# EAGLE design Precision LPC no USB (EAGLE 6.2)
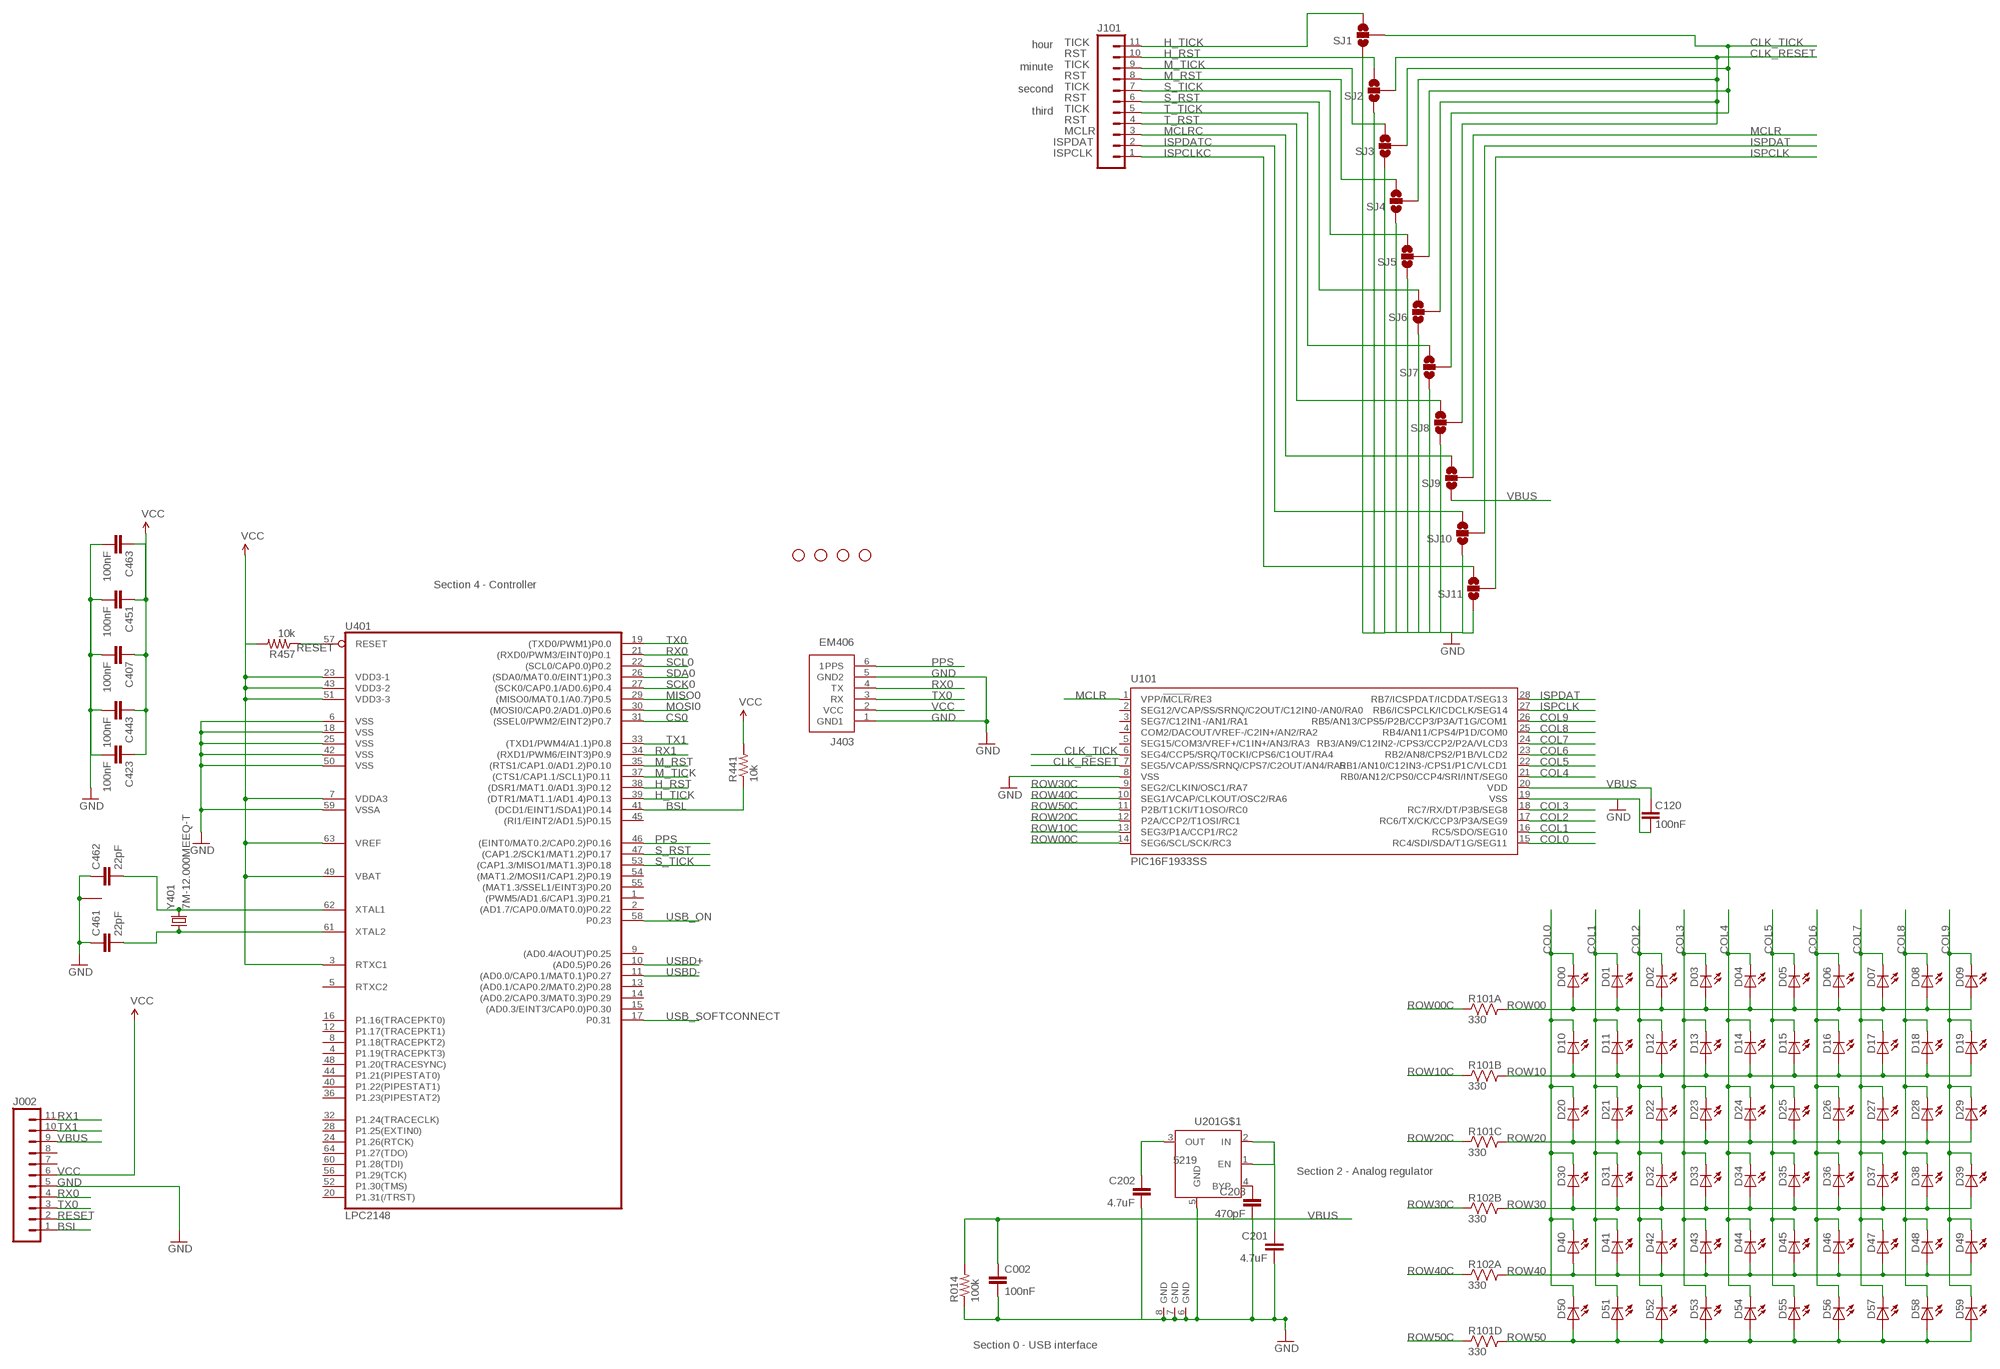
[diagram p0: schematic, sheet 1]

## Parts
C002  100nF  CAP0402-CAP  [0402-CAP]
C120  100nF  CAP0402-CAP  [0402-CAP]
C201  4.7uF  CAP0402-CAP  [0402-CAP]
C202  4.7uF  CAP0402-CAP  [0402-CAP]
C203  470pF  CAP0402-CAP  [0402-CAP]
C407  100nF  CAP0402-CAP  [0402-CAP]
C423  100nF  CAP0402-CAP  [0402-CAP]
C443  100nF  CAP0402-CAP  [0402-CAP]
C451  100nF  CAP0402-CAP  [0402-CAP]
C461  22pF  CAP0402-CAP  [0402-CAP]
C462  22pF  CAP0402-CAP  [0402-CAP]
C463  100nF  CAP0402-CAP  [0402-CAP]
D00  LED3MM  [LED3MM]
D01  LED3MM  [LED3MM]
D02  LED3MM  [LED3MM]
D03  LED3MM  [LED3MM]
D04  LED3MM  [LED3MM]
D05  LED3MM  [LED3MM]
D06  LED3MM  [LED3MM]
D07  LED3MM  [LED3MM]
D08  LED3MM  [LED3MM]
D09  LED3MM  [LED3MM]
D10  LED3MM  [LED3MM]
D11  LED3MM  [LED3MM]
D12  LED3MM  [LED3MM]
D13  LED3MM  [LED3MM]
D14  LED3MM  [LED3MM]
D15  LED3MM  [LED3MM]
D16  LED3MM  [LED3MM]
D17  LED3MM  [LED3MM]
D18  LED3MM  [LED3MM]
D19  LED3MM  [LED3MM]
D20  LED3MM  [LED3MM]
D21  LED3MM  [LED3MM]
D22  LED3MM  [LED3MM]
D23  LED3MM  [LED3MM]
D24  LED3MM  [LED3MM]
D25  LED3MM  [LED3MM]
D26  LED3MM  [LED3MM]
D27  LED3MM  [LED3MM]
D28  LED3MM  [LED3MM]
D29  LED3MM  [LED3MM]
D30  LED3MM  [LED3MM]
D31  LED3MM  [LED3MM]
D32  LED3MM  [LED3MM]
D33  LED3MM  [LED3MM]
D34  LED3MM  [LED3MM]
D35  LED3MM  [LED3MM]
D36  LED3MM  [LED3MM]
D37  LED3MM  [LED3MM]
D38  LED3MM  [LED3MM]
D39  LED3MM  [LED3MM]
D40  LED3MM  [LED3MM]
D41  LED3MM  [LED3MM]
D42  LED3MM  [LED3MM]
D43  LED3MM  [LED3MM]
D44  LED3MM  [LED3MM]
D45  LED3MM  [LED3MM]
D46  LED3MM  [LED3MM]
D47  LED3MM  [LED3MM]
D48  LED3MM  [LED3MM]
D49  LED3MM  [LED3MM]
D50  LED3MM  [LED3MM]
D51  LED3MM  [LED3MM]
D52  LED3MM  [LED3MM]
D53  LED3MM  [LED3MM]
D54  LED3MM  [LED3MM]
D55  LED3MM  [LED3MM]
D56  LED3MM  [LED3MM]
D57  LED3MM  [LED3MM]
D58  LED3MM  [LED3MM]
D59  LED3MM  [LED3MM]
J002  M11PTH  [1X11]
J101  M11PTH  [1X11]
J403  EM406  [EM406@1]
JP3  STAND-OFF  [STAND-OFF]
JP4  STAND-OFF  [STAND-OFF]
JP5  STAND-OFF  [STAND-OFF]
JP6  STAND-OFF  [STAND-OFF]
R014  100k  RESISTOR0402-RES  [0402-RES]
R101  330  CRA06S-8  [CRA06]
R102  330  CRA06S-8  [CRA06]
R441  10k  RESISTOR0402-RES  [0402-RES]
R457  10k  RESISTOR0402-RES  [0402-RES]
SJ1  SOLDERJUMPER_2WAYS  [SJ_3]
SJ2  SOLDERJUMPER_2WAYS  [SJ_3]
SJ3  SOLDERJUMPER_2WAYS  [SJ_3]
SJ4  SOLDERJUMPER_2WAYS  [SJ_3]
SJ5  SOLDERJUMPER_2WAYS  [SJ_3]
SJ6  SOLDERJUMPER_2WAYS  [SJ_3]
SJ7  SOLDERJUMPER_2WAYS  [SJ_3]
SJ8  SOLDERJUMPER_2WAYS  [SJ_3]
SJ9  SOLDERJUMPER_2WAYS  [SJ_3]
SJ10  SOLDERJUMPER_2WAYS  [SJ_3]
SJ11  SOLDERJUMPER_2WAYS  [SJ_3]
U101  PIC16F1933SS  [SSOP28]
U201  5219  MIC5219FMM  [MSOP08]
U401  LPC2148  LPC213X  [SQFP-S-10X10-64]
Y401  7M-12.000MEEQ-T  TSX-3225  [CRYSTAL_SMD]

## Nets
BSL: J002.1 R441.1 U401.41((DCD1/EINT1/SDA1)P0.14)
CLK_RESET: SJ2.2 SJ4.2 SJ6.2 SJ8.2 U101.7(SEG5/VCAP/SS/SRNQ/CPS7/C2OUT/AN4/RA5)
CLK_TICK: SJ1.2 SJ3.2 SJ5.2 SJ7.2 U101.6(SEG4/CCP5/SRQ/T0CKI/CPS6/C1OUT/RA4)
COL0: D00.K(C) D10.K(C) D20.K(C) D30.K(C) D40.K(C) D50.K(C) U101.15(RC4/SDI/SDA/T1G/SEG11)
COL1: D01.K(C) D11.K(C) D21.K(C) D31.K(C) D41.K(C) D51.K(C) U101.16(RC5/SDO/SEG10)
COL2: D02.K(C) D12.K(C) D22.K(C) D32.K(C) D42.K(C) D52.K(C) U101.17(RC6/TX/CK/CCP3/P3A/SEG9)
COL3: D03.K(C) D13.K(C) D23.K(C) D33.K(C) D43.K(C) D53.K(C) U101.18(RC7/RX/DT/P3B/SEG8)
COL4: D04.K(C) D14.K(C) D24.K(C) D34.K(C) D44.K(C) D54.K(C) U101.21(RB0/AN12/CPS0/CCP4/SRI/INT/SEG0)
COL5: D05.K(C) D15.K(C) D25.K(C) D35.K(C) D45.K(C) D55.K(C) U101.22(RB1/AN10/C12IN3-/CPS1/P1C/VLCD1)
COL6: D06.K(C) D16.K(C) D26.K(C) D36.K(C) D46.K(C) D56.K(C) U101.23(RB2/AN8/CPS2/P1B/VLCD2)
COL7: D07.K(C) D17.K(C) D27.K(C) D37.K(C) D47.K(C) D57.K(C) U101.24(RB3/AN9/C12IN2-/CPS3/CCP2/P2A/VLCD3)
COL8: D08.K(C) D18.K(C) D28.K(C) D38.K(C) D48.K(C) D58.K(C) U101.25(RB4/AN11/CPS4/P1D/COM0)
COL9: D09.K(C) D19.K(C) D29.K(C) D39.K(C) D49.K(C) D59.K(C) U101.26(RB5/AN13/CPS5/P2B/CCP3/P3A/T1G/COM1)
CS0: U401.31((SSEL0/PWM2/EINT2)P0.7)
GND [power]: C002.2 C120.1 C201.2 C202.2 C203.2 C407.2 C423.2 C443.2 C451.2 C461.1 C462.1 C463.2 J002.5 J403.1(GND1) J403.5(GND2) R014.1 SJ1.1 SJ2.1 SJ3.1 SJ4.1 SJ5.1 SJ6.1 SJ7.1 SJ8.1 SJ10.1 SJ11.1 U101.8(VSS) U101.19(VSS) U201.5(GND) U201.6(GND) U201.7(GND) U201.8(GND) U401.6(VSS) U401.18(VSS) U401.25(VSS) U401.42(VSS) U401.50(VSS) U401.59(VSSA) Y401.2 Y401.4
H_RST: J101.10 SJ2.3 U401.38((DSR1/MAT1.0/AD1.3)P0.12)
H_TICK: J101.11 SJ1.3 U401.39((DTR1/MAT1.1/AD1.4)P0.13)
ISPCLK: SJ11.2 U101.27(RB6/ICSPCLK/ICDCLK/SEG14)
ISPCLKC: J101.1 SJ11.3
ISPDAT: SJ10.2 U101.28(RB7/ICSPDAT/ICDDAT/SEG13)
ISPDATC: J101.2 SJ10.3
M_RST: J101.8 SJ4.3 U401.35((RTS1/CAP1.0/AD1.2)P0.10)
M_TICK: J101.9 SJ3.3 U401.37((CTS1/CAP1.1/SCL1)P0.11)
MCLR: SJ9.2 U101.1(VPP/!MCLR!/RE3)
MCLRC: J101.3 SJ9.3
MISO0: U401.29((MISO0/MAT0.1/A0.7)P0.5)
MOSI0: U401.30((MOSI0/CAP0.2/AD1.0)P0.6)
N$1 [power]: C202.1 U201.3(OUT)
N$3: C203.1 U201.4(BYP)
PPS: J403.6(1PPS) U401.46((EINT0/MAT0.2/CAP0.2)P0.16)
RESET: J002.2 R457.1 U401.57(RESET)
ROW00: D00.A D01.A D02.A D03.A D04.A D05.A D06.A D07.A D08.A D09.A R101.8
ROW00C: R101.1 U101.14(SEG6/SCL/SCK/RC3)
ROW10: D10.A D11.A D12.A D13.A D14.A D15.A D16.A D17.A D18.A D19.A R101.7
ROW10C: R101.2 U101.13(SEG3/P1A/CCP1/RC2)
ROW20: D20.A D21.A D22.A D23.A D24.A D25.A D26.A D27.A D28.A D29.A R101.6
ROW20C: R101.3 U101.12(P2A/CCP2/T1OSI/RC1)
ROW30: D30.A D31.A D32.A D33.A D34.A D35.A D36.A D37.A D38.A D39.A R102.7
ROW30C: R102.2 U101.9(SEG2/CLKIN/OSC1/RA7)
ROW40: D40.A D41.A D42.A D43.A D44.A D45.A D46.A D47.A D48.A D49.A R102.8
ROW40C: R102.1 U101.10(SEG1/VCAP/CLKOUT/OSC2/RA6)
ROW50: D50.A D51.A D52.A D53.A D54.A D55.A D56.A D57.A D58.A D59.A R101.5
ROW50C: R101.4 U101.11(P2B/T1CKI/T1OSO/RC0)
RX0: J002.4 J403.4(TX) U401.21((RXD0/PWM3/EINT0)P0.1)
RX1: J002.11 U401.34((RXD1/PWM6/EINT3)P0.9)
S_RST: J101.6 SJ6.3 U401.47((CAP1.2/SCK1/MAT1.2)P0.17)
S_TICK: J101.7 SJ5.3 U401.53((CAP1.3/MISO1/MAT1.3)P0.18)
SCK0: U401.27((SCK0/CAP0.1/AD0.6)P0.4)
SCL0: U401.22((SCL0/CAP0.0)P0.2)
SDA0: U401.26((SDA0/MAT0.0/EINT1)P0.3)
T_RST: J101.4 SJ8.3
T_TICK: J101.5 SJ7.3
TX0: J002.3 J403.3(RX) U401.19((TXD0/PWM1)P0.0)
TX1: J002.10 U401.33((TXD1/PWM4/A1.1)P0.8)
USB_ON: U401.58(P0.23)
USB_SOFTCONNECT: U401.17(P0.31)
USBD+: U401.10((AD0.5)P0.26)
USBD-: U401.11((AD0.0/CAP0.1/MAT0.1)P0.27)
VBUS: C002.1 C120.2 C201.1 J002.9 R014.2 SJ9.1 U101.20(VDD) U201.1(EN) U201.2(IN)
VCC [power]: C407.1 C423.1 C443.1 C451.1 C463.1 J002.6 J403.2(VCC) R441.2 R457.2 U401.3(RTXC1) U401.7(VDDA3) U401.23(VDD3-1) U401.43(VDD3-2) U401.49(VBAT) U401.51(VDD3-3) U401.63(VREF)
XTAL3: C462.2 U401.62(XTAL1) Y401.3
XTAL4: C461.2 U401.61(XTAL2) Y401.1
Unconnected: J002.7 J002.8 R102.3 R102.4 R102.5 R102.6 U101.2(SEG12/VCAP/SS/SRNQ/C2OUT/C12IN0-/AN0/RA0) U101.3(SEG7/C12IN1-/AN1/RA1) U101.4(COM2/DACOUT/VREF-/C2IN+/AN2/RA2) U101.5(SEG15/COM3/VREF+/C1IN+/AN3/RA3) U401.1((PWM5/AD1.6/CAP1.3)P0.21) U401.2((AD1.7/CAP0.0/MAT0.0)P0.22) U401.4(P1.19(TRACEPKT3)) U401.5(RTXC2) U401.8(P1.18(TRACEPKT2)) U401.9((AD0.4/AOUT)P0.25) U401.12(P1.17(TRACEPKT1)) U401.13((AD0.1/CAP0.2/MAT0.2)P0.28) U401.14((AD0.2/CAP0.3/MAT0.3)P0.29) U401.15((AD0.3/EINT3/CAP0.0)P0.30) U401.16(P1.16(TRACEPKT0)) U401.20(P1.31(/TRST)) U401.24(P1.26(RTCK)) U401.28(P1.25(EXTIN0)) U401.32(P1.24(TRACECLK)) U401.36(P1.23(PIPESTAT2)) U401.40(P1.22(PIPESTAT1)) U401.44(P1.21(PIPESTAT0)) U401.45((RI1/EINT2/AD1.5)P0.15) U401.48(P1.20(TRACESYNC)) U401.52(P1.30(TMS)) U401.54((MAT1.2/MOSI1/CAP1.2)P0.19) U401.55((MAT1.3/SSEL1/EINT3)P0.20) U401.56(P1.29(TCK)) U401.60(P1.28(TDI)) U401.64(P1.27(TDO))

## Notes on the sheet
- hour
- TICK
- RST
- minute
- TICK
- RST
- second
- TICK
- RST
- third
- TICK
- RST
- MCLR
- ISPDAT
- ISPCLK
- Section 4 - Controller
- Section 2 - Analog regulator
- Section 0 - USB interface

## Library data of the parts
C002 C120 C201-C203 C407 C423 C443 C451 C461-C463 = SparkFun:CAP: Capacitor Standard 0603 ceramic capacitor, and 0.1" leaded capacitor.
D00 D01-D09 D10-D59 = SparkFun:LED: LEDs Standard schematic elements and footprints for 5mm, 3mm, 1206, and 0603 sized LEDs. 5mm - Spark Fun Electronics SKU : COM-00529 (and others)
J002 J101 = SparkFun:M11: Header 11 Standard 11-pin 0.1" header. Use with straight break away headers (SKU : PRT-00116), right angle break away headers (PRT-00553), swiss pins (PRT-00743), machine pins (PRT-00117), and female headers (PRT-00115).
J403 = SparkFun:EM406: EM406 Connector Proven layout and schematic for EM406 connector. Spark Fun Electronics SKU : GPS-00579
JP3-JP6 = SparkFun:STAND-OFF: Stand Off This is the mechanical footprint for a #4 phillips button head screw. Use the keepout ring to avoid running the screw head into surrounding components. SKU : PRT-00447
R014 R441 R457 = SparkFun:RESISTOR: Resistor Basic schematic elements and footprints for 0603, 1206, and PTH resistors.
R101 R102 = KwanSystems:CRA06S-8
SJ1-SJ11 = SparkFun:SOLDERJUMPER_2WAY: Solder Jumper 2 way solder jumper
U101 = microchip:PIC16F19*: Flash-Based, 8-Bit CMOS Microcontrollers wtih LCD Driver and nanoWatt XLP Technology Auto generated by make-symbol-device-package-bsdl.ulp Rev. 33 Source: http://ww1.microchip.com/downloads/en/DeviceDoc/41364D.pdf; MPN: PIC16F1933T-I/SS; OC_FARNELL: 1755815; OC_NEWARK: 08R1942
U201 = v-reg-micrel:MIC5219FMM: VOLTAGE REGULATOR; OC_FARNELL: unknown; OC_NEWARK: unknown
U401 = SparkFun:LPC213X: LPC213x Schematic element and footprint for NXP LPC213x. Spark Fun Electronics SKU : COM-00520
Y401 = KwanSystems:TSX-3225

## Net classes
0 default: width 0.203 mm, drill 0.508 mm, clearance 0.203 mm
1 power: width 0.203 mm, drill 0.508 mm, clearance 0.203 mm
2 hv: width 0.203 mm, drill 0.508 mm, clearance 0.203 mm

## Board
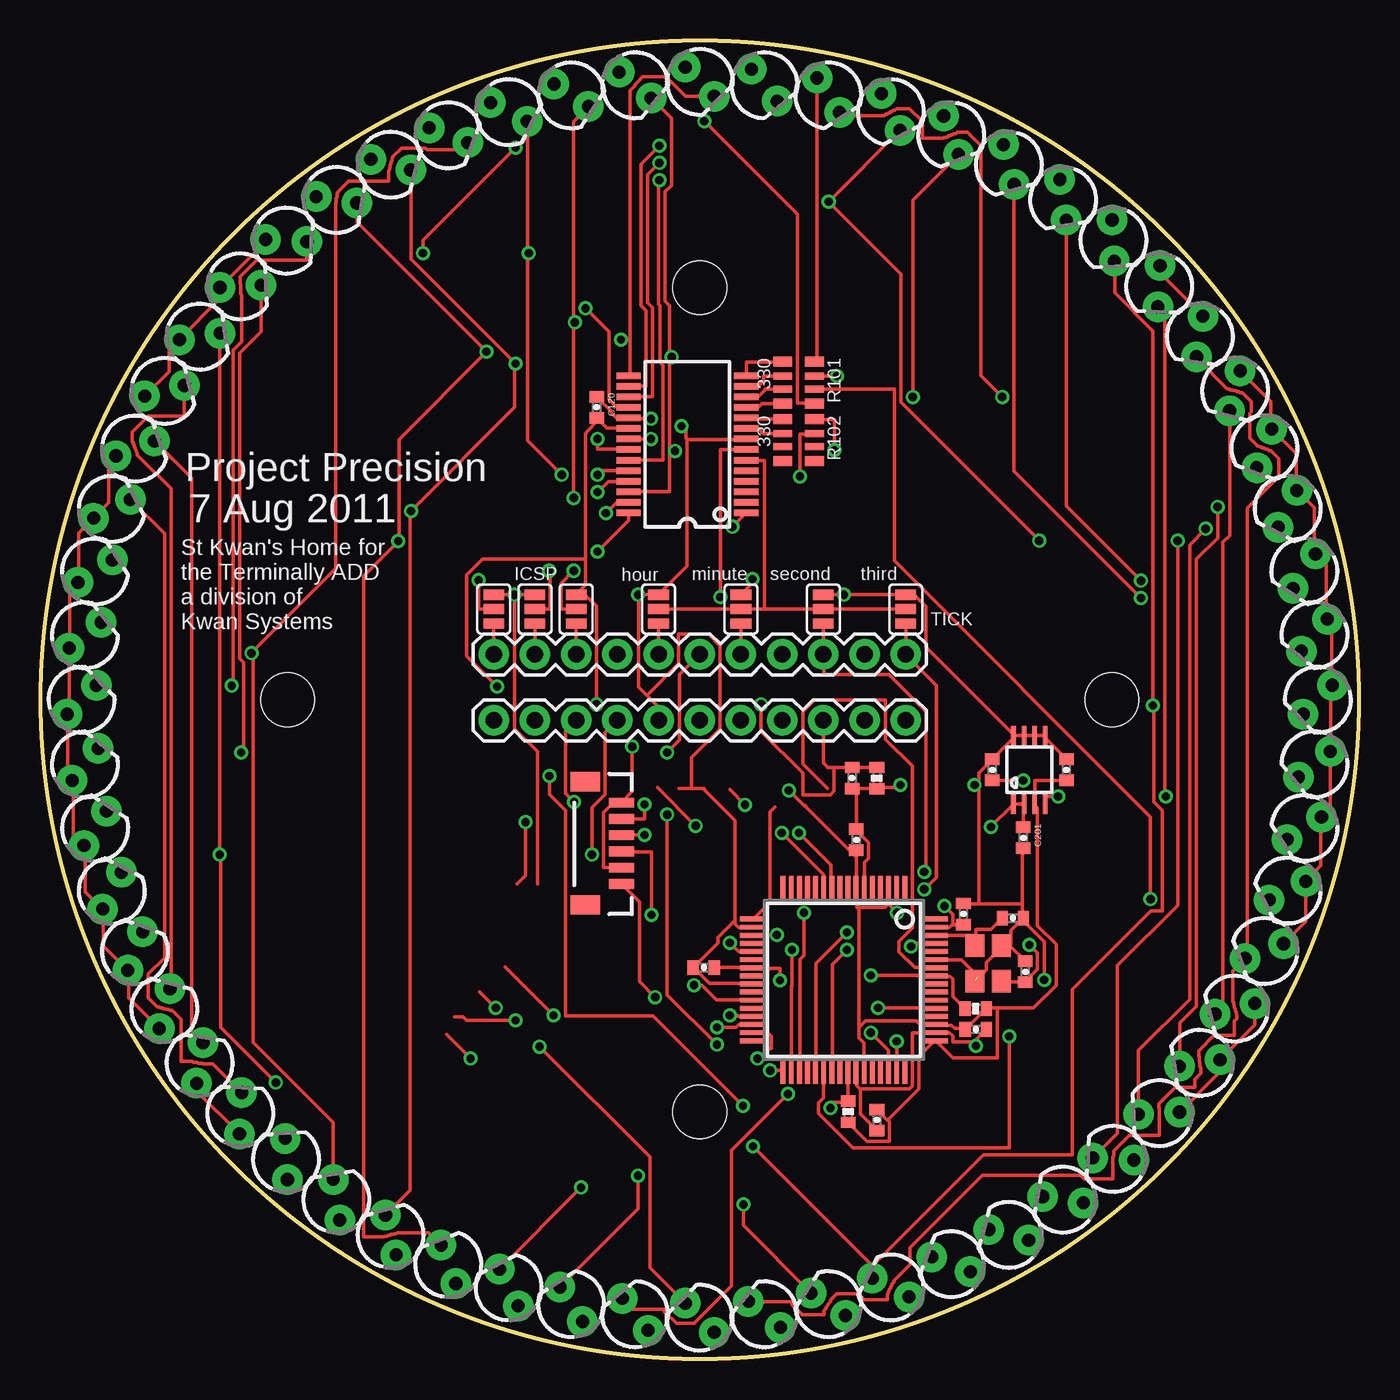
[diagram p1: board, top side]
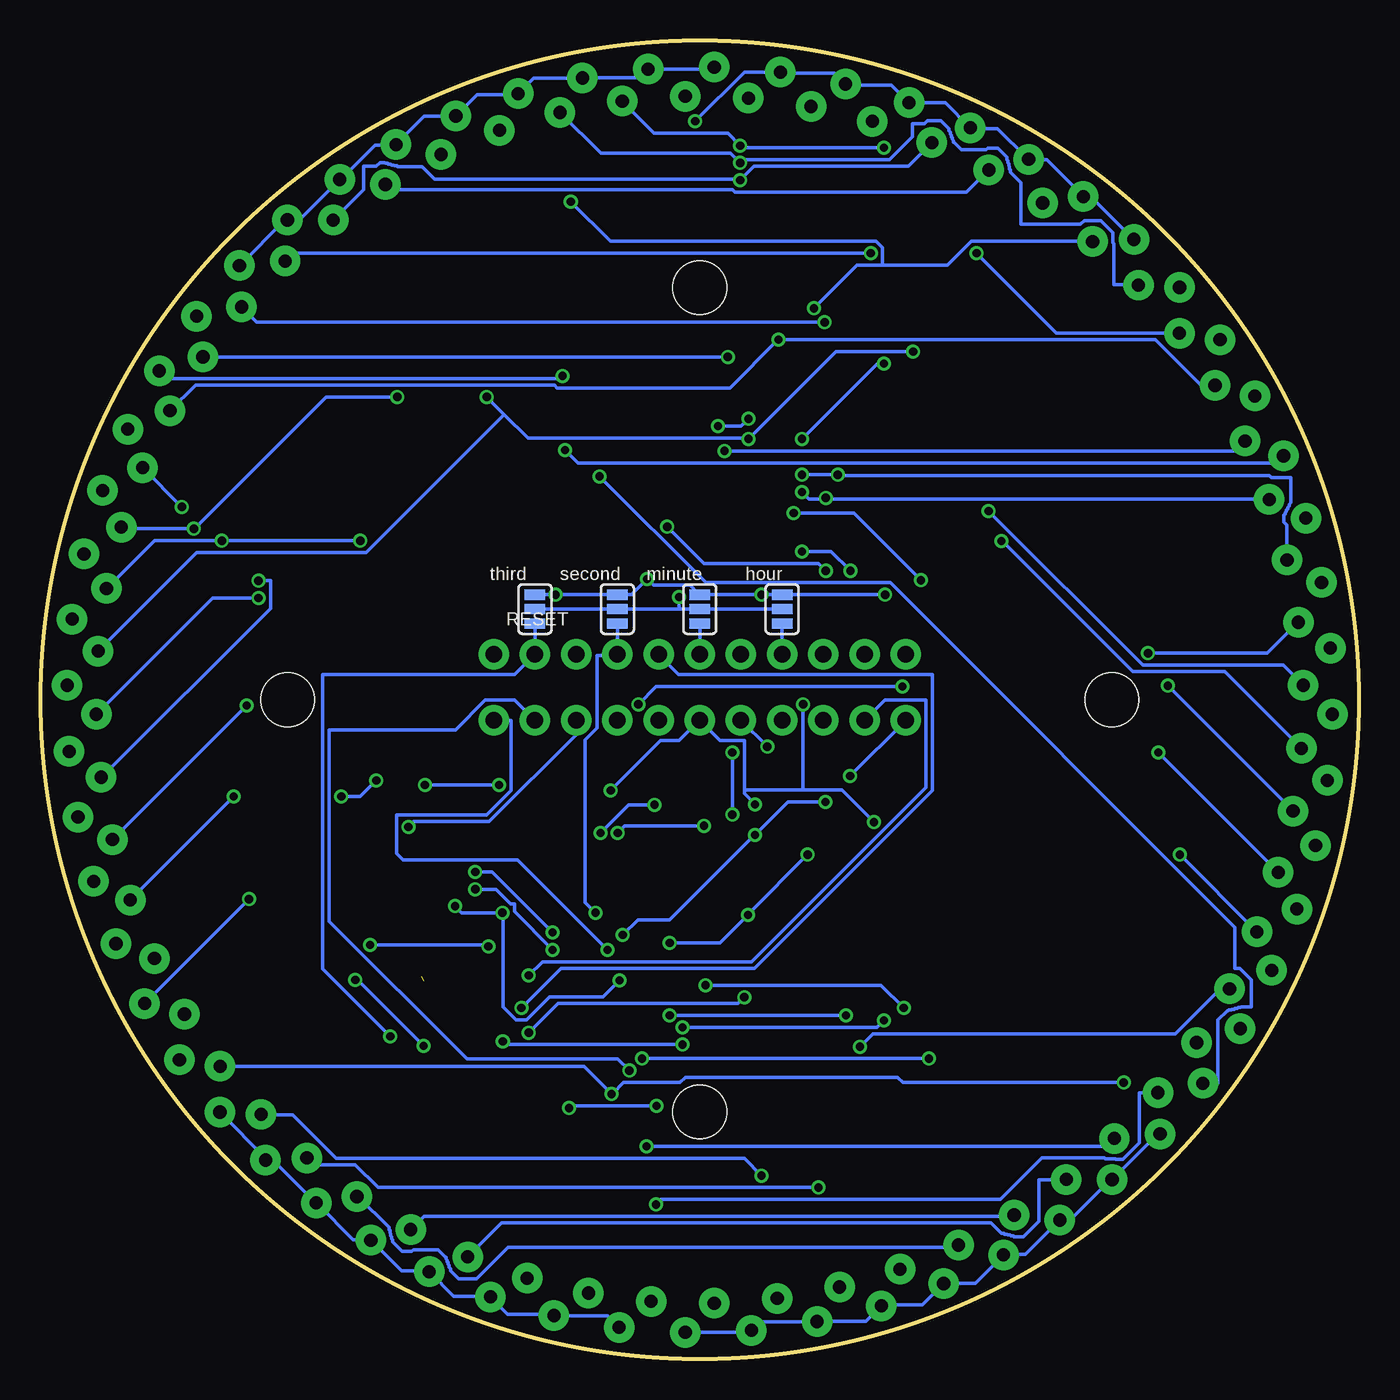
[diagram p2: board, bottom side, seen from below]

Size 81.28 x 81.28 mm. Coordinates in mm from the lower left corner, seen from the top.
Outline: circle at 40.64,40.64 radius 40.64
Copper layers (1*16): Top 0.0356mm / dielectric 1.5011mm / Bottom 0.0356mm
Design rules: minimum track width 8mil, minimum drill 20mil, track to track 8mil, track to pad 8mil, pad to pad 8mil, via to via 8mil, smd to smd 8mil, copper to edge 15mil, drill to drill 6mil, minimum pad ring 7mil, minimum via ring 7mil, stop-mask expansion 4mil, vias tented up to drill 20mil, thermal gap 10mil

### Footprints (pad centres in the part's own frame; a part is rotated, then mirrored left to right if it is on the bottom)
0402-CAP = smd 0.7 x 0.9: 1 -0.65,0; 2 0.65,0
LED3MM = drill 0.813 pad 1.88: A -1.27,0; K 1.27,0
1X11 = drill 1.016 pad 1.88: 1 0,0; 2 2.54,0; 3 5.08,0; 4 7.62,0; 5 10.16,0; 6 12.7,0; 7 15.24,0; 8 17.78,0; 9 20.32,0; 10 22.86,0; 11 25.4,0
EM406@1 = smd 0.6 x 1.55: 1 0,0; 2 1,0; 3 2,0; 4 3,0; 5 4,0; 6 5,0 | smd 1.2 x 1.8: P$1 -1.3,-2.225; P$2 6.3,-2.225
STAND-OFF = hole 3.302: 0,0
0402-RES = smd 0.7 x 0.9: 1 -0.65,0; 2 0.65,0
CRA06 = smd 0.63 x 1.15: 1 -1.295,-0.975; 4 1.295,-0.975; 5 1.295,0.975; 8 -1.295,0.975 | smd 0.44 x 1.15: 2 -0.4,-0.975; 3 0.4,-0.975; 6 0.4,0.975; 7 -0.4,0.975
SJ_3 = smd 0.635 x 1.27: 1 -0.889,0; 2 0,0; 3 0.889,0
SSOP28 = smd 0.4 x 1.5: 1 -4.225,-3.625; 2 -3.575,-3.625; 3 -2.925,-3.625; 4 -2.275,-3.625; 5 -1.625,-3.625; 6 -0.975,-3.625; 7 -0.325,-3.625; 8 0.325,-3.625; 9 0.975,-3.625; 10 1.625,-3.625; 11 2.275,-3.625; 12 2.925,-3.625; 13 3.575,-3.625; 14 4.225,-3.625; 15 4.225,3.625; 16 3.575,3.625; 17 2.925,3.625; 18 2.275,3.625; 19 1.625,3.625; 20 0.975,3.625; 21 0.325,3.625; 22 -0.325,3.625; 23 -0.975,3.625; 24 -1.625,3.625; 25 -2.275,3.625; 26 -2.925,3.625; 27 -3.575,3.625; 28 -4.225,3.625
MSOP08 = smd 0.3 x 1.2: 1 -0.976,-2.113; 2 -0.326,-2.113; 3 0.324,-2.113; 4 0.974,-2.113; 5 0.974,2.112; 6 0.324,2.112; 7 -0.326,2.112; 8 -0.976,2.112
SQFP-S-10X10-64 = smd 0.3 x 1.6: 1 -3.75,-5.6; 2 -3.25,-5.6; 3 -2.75,-5.6; 4 -2.25,-5.6; 5 -1.75,-5.6; 6 -1.25,-5.6; 7 -0.75,-5.6; 8 -0.25,-5.6; 9 0.25,-5.6; 10 0.75,-5.6; 11 1.25,-5.6; 12 1.75,-5.6; 13 2.25,-5.6; 14 2.75,-5.6; 15 3.25,-5.6; 16 3.75,-5.6; 33 3.75,5.6; 34 3.25,5.6; 35 2.75,5.6; 36 2.25,5.6; 37 1.75,5.6; 38 1.25,5.6; 39 0.75,5.6; 40 0.25,5.6; 41 -0.25,5.6; 42 -0.75,5.6; 43 -1.25,5.6; 44 -1.75,5.6; 45 -2.25,5.6; 46 -2.75,5.6; 47 -3.25,5.6; 48 -3.75,5.6 | smd 1.6 x 0.3: 17 5.6,-3.75; 18 5.6,-3.25; 19 5.6,-2.75; 20 5.6,-2.25; 21 5.6,-1.75; 22 5.6,-1.25; 23 5.6,-0.75; 24 5.6,-0.25; 25 5.6,0.25; 26 5.6,0.75; 27 5.6,1.25; 28 5.6,1.75; 29 5.6,2.25; 30 5.6,2.75; 31 5.6,3.25; 32 5.6,3.75; 49 -5.6,3.75; 50 -5.6,3.25; 51 -5.6,2.75; 52 -5.6,2.25; 53 -5.6,1.75; 54 -5.6,1.25; 55 -5.6,0.75; 56 -5.6,0.25; 57 -5.6,-0.25; 58 -5.6,-0.75; 59 -5.6,-1.25; 60 -5.6,-1.75; 61 -5.6,-2.25; 62 -5.6,-2.75; 63 -5.6,-3.25; 64 -5.6,-3.75
CRYSTAL_SMD = smd 1.4 x 1.15: 1 -1.092,-0.813; 2 1.092,-0.813; 3 1.092,0.813; 4 -1.092,0.813

### Placement (x,y rotation side)
C002  50.04,35.81 270 top
C120  34.29,58.67 270 top
C201  60.58,32.13 270 top
C202  63.25,36.32 90 top
C203  58.67,36.32 90 top
C407  50.29,32 90 top
C423  40.89,24.13 180 top
C443  51.56,14.73 270 top
C451  57.66,20.32 0 top
C461  60.71,23.88 270 top
C462  59.94,27.18 180 top
C463  56.9,27.43 90 top
D00  40.64,78.74 315 top
D01  44.62,78.53 309 top
D02  48.56,77.91 303 top
D03  52.41,76.88 297 top
D04  56.14,75.45 291 top
D05  59.69,73.63 285 top
D06  63.04,71.46 279 top
D07  66.13,68.95 273 top
D08  68.95,66.13 267 top
D09  71.46,63.04 261 top
D10  73.63,59.69 255 top
D11  75.45,56.14 249 top
D12  76.88,52.41 243 top
D13  77.91,48.56 237 top
D14  78.53,44.62 231 top
D15  78.74,40.64 225 top
D16  78.53,36.66 219 top
D17  77.91,32.72 213 top
D18  76.88,28.87 207 top
D19  75.45,25.14 201 top
D20  73.63,21.59 195 top
D21  71.46,18.24 189 top
D22  68.95,15.15 183 top
D23  66.13,12.33 177 top
D24  63.04,9.82 171 top
D25  59.69,7.65 165 top
D26  56.14,5.83 159 top
D27  52.41,4.4 153 top
D28  48.56,3.37 147 top
D29  44.62,2.75 141 top
D30  40.64,2.54 135 top
D31  36.66,2.75 129 top
D32  32.72,3.37 123 top
D33  28.87,4.4 117 top
D34  25.14,5.83 111 top
D35  21.59,7.65 105 top
D36  18.24,9.82 99 top
D37  15.15,12.33 93 top
D38  12.33,15.15 87 top
D39  9.82,18.24 81 top
D40  7.65,21.59 75 top
D41  5.83,25.14 69 top
D42  4.4,28.87 63 top
D43  3.37,32.72 57 top
D44  2.75,36.66 51 top
D45  2.54,40.64 45 top
D46  2.75,44.62 39 top
D47  3.37,48.56 33 top
D48  4.4,52.41 27 top
D49  5.83,56.14 21 top
D50  7.65,59.69 15 top
D51  9.82,63.04 9 top
D52  12.33,66.13 3 top
D53  15.15,68.95 357 top
D54  18.24,71.46 351 top
D55  21.59,73.63 345 top
D56  25.14,75.45 339 top
D57  28.87,76.88 333 top
D58  32.72,77.91 327 top
D59  36.66,78.53 321 top
J002  27.94,39.37 0 top
J101  27.94,43.43 0 top
J403  35.81,34.29 270 top
JP3  66.04,40.64 0 top
JP4  40.64,66.04 0 top
JP5  15.24,40.64 0 top
JP6  40.64,15.24 0 top
R014  51.56,35.81 90 top
R101  46.74,60.2 270 top
R102  46.74,56.64 270 top
R441  49.78,15.24 270 top
R457  57.66,21.59 0 top
SJ1  53.34,46.23 270 top
SJ2  50.8,46.23 270 bottom
SJ3  48.26,46.23 270 top
SJ4  45.72,46.23 270 bottom
SJ5  43.18,46.23 270 top
SJ6  40.64,46.23 270 bottom
SJ7  38.1,46.23 270 top
SJ8  35.56,46.23 270 bottom
SJ9  33.02,46.23 270 top
SJ10  30.48,46.23 270 top
SJ11  27.94,46.23 270 top
U101  39.88,56.39 90 top
U201  60.96,36.32 0 top
U401  49.53,23.37 180 top
Y401  58.42,24.38 90 top

### Tracks (layer width: path | path; a pad name or v marks a point on that pad's centre or on a via)
BSL  (via drill 0.51)
  Top 0.203: U401.41 49.78,17.75 R441.1 49.71,15.82 48.69,15.82 v48.69,15.47 | v43.31,15.6 37.74,21.16 32.36,21.16 32.36,33.81 31.37,34.8 v31.37,35.94
  Bottom 0.203: v48.69,15.47 48.56,15.6 v43.31,15.6 | v31.37,35.94 J002.1
CLK_RESET  (via drill 0.51)
  Top 0.203: v41.91,46.97 41.91,56.06 43.48,56.06 U101.7
  Bottom 0.203: SJ8.2 SJ6.2 41.91,46.23 | 41.91,46.23 SJ4.2 SJ2.2 | 41.91,46.23 v41.91,46.97
CLK_TICK
  Top 0.203: SJ7.2 SJ5.2 44.63,46.23 | 44.63,46.23 SJ3.2 SJ1.2 | U101.6 43.51,55.4 44.63,55.4 44.63,46.23
COL0  (via drill 0.51)
  Top 0.203: D20.K 72.42,21.29 72.9,21.77 72.9,50.37 73.3,50.77 73.3,58.45 D10.K | 36.35,62.84 36.35,78.18 36.65,78.49 36.65,78.56 36.96,78.87 36.96,78.89 37.11,79.05 38.56,79.05 39.75,77.85 D00.K | 36.35,62.84 36.35,60.71 36.27,60.63 U101.15 | D40.K 7.98,22.84 8.05,22.91 8.05,53.65 5.97,55.73 5.97,55.85 5.89,55.93 5.89,56.03 5.84,56.08 5.84,56.19 5.77,56.26 5.77,56.36 5.71,56.41 5.71,56.52 5.66,56.57 5.66,57.15 6.63,58.12 8.87,58.12 8.87,59.99 D50.K | v30.76,19.25 37.57,12.45 37.57,5.61 39.73,3.45 D30.K | v35.79,62.84 36.35,62.84
  Bottom 0.203: v30.76,19.25 29.97,20.04 11.33,20.04 8.56,22.81 D40.K | D50.K 8.89,60.02 9.73,60.02 12.55,62.84 v35.79,62.84 35.87,62.79 38.79,59.87 49.43,59.87 49.61,60.05 71.73,60.05 D10.K
COL1  (via drill 0.51)
  Top 0.203: v46.08,16.33 42.6,12.85 42.6,4.52 40.31,2.23 40.31,2.18 39.22,2.18 38.48,2.92 38.48,3.07 36.52,3.07 D31.K | v72.57,52.53 72.57,50.62 71.25,49.3 71.25,21.74 70.23,20.73 70.23,18.06 D21.K | v38.15,74.8 37.01,73.66 37.01,64.95 37.31,64.64 37.31,59.97 36.27,59.97 U101.16 | D51.K 11.05,63.22 v11.05,31.09 11.1,31.01 11.1,20.45 v14.5,17.04 | v29.29,74.68 23.57,68.96 v23.57,68.17
  Bottom 0.203: D21.K 70.21,18.03 47.78,18.03 v46.08,16.33 46,16.38 45.34,17.04 41.86,17.04 41.53,17.37 28.45,17.37 28.12,17.04 v14.5,17.04 | v72.57,52.53 D11.K | D01.K 45.41,77.52 43.46,75.56 38.91,75.56 v38.15,74.8 38.08,74.75 38,74.68 v29.29,74.68 | v11.05,31.09 D41.K | v23.57,68.17 18.64,63.25 11.07,63.25 D51.K
COL2  (via drill 0.51)
  Top 0.203: v36.83,11.3 36.83,9.25 D32.K | v71.83,51.18 70.84,50.19 70.84,22.17 67.69,19.02 D22.K | v38.15,73.74 37.41,73 37.41,65.13 37.72,64.82 37.72,59.33 36.27,59.33 U101.17 | v12.37,37.39 12.52,37.54 12.52,42.93 12.27,43.18 12.27,62 13.59,63.32 D52.K | v59.28,59.31 57.96,60.63 57.96,74.8 57.15,75.62 56.52,75.62 56.44,75.54 56.31,75.54 56.24,75.46 56.13,75.46 56.08,75.41 55.98,75.41 55.91,75.34 55.8,75.34 55.75,75.29 55.68,75.29 55.65,75.26 54.36,75.26 54.36,76.3 53.57,77.09 52.78,77.09 52.68,76.99 52.58,76.99 52.48,76.89 52.4,76.89 52.32,76.81 52.25,76.81 52.17,76.73 52.09,76.73 52.02,76.66 49.28,76.66 49.28,76.83 D02.K
  Bottom 0.203: v36.83,11.3 37.9,12.37 63.04,12.37 65.73,15.06 67.67,15.06 D22.K | D12.K 76.28,51.26 76.2,51.18 v71.83,51.18 71.75,51.23 63.68,59.31 v59.28,59.31 | D02.K 46.74,74.32 38.73,74.32 v38.15,73.74 38.08,73.79 37.92,73.94 28.96,73.94 27.53,75.36 27.53,76.15 26.8,76.15 26.59,76.35 25.78,76.35 25.27,75.84 25.27,75.72 25.2,75.64 25.2,75.51 25.12,75.44 25.12,75.34 25.07,75.29 25.07,75.18 24.99,75.11 24.99,75.01 24.97,75.01 24.51,74.55 22.99,74.55 22.89,74.65 22.25,74.65 21.69,74.09 21.69,73.94 21.64,73.89 21.64,73.74 21.59,73.69 21.59,73.56 21.54,73.51 21.54,73.36 21.49,73.3 21.49,73.18 20.83,72.52 20.83,69.95 17.17,69.95 16.94,70.18 15.9,70.18 15.16,69.44 15.16,68.81 15.11,68.76 15.11,66.22 13.61,66.22 D52.K | v12.37,37.39 5,30.02 D42.K
COL3  (via drill 0.51)
  Top 0.203: v33.33,10.57 D33.K | v33.6,64.77 35.05,63.32 35.05,59.13 35.51,58.67 36.25,58.67 U101.18 | v11.79,41.5 11.86,41.58 11.86,62.18 12.39,62.71 12.39,65.58 12.34,65.63 12.34,66.27 12.32,66.29 12.32,66.73 13.34,67.74 16.41,67.74 D53.K | D03.K v48.59,71.35 48.64,71.27 53.03,66.88 53.03,58.98 v61.57,50.44 | v70.1,50.44 70.1,27.96 66.4,24.26 66.4,13.92 D23.K
  Bottom 0.203: v33.33,10.57 60.48,10.57 61.87,11.96 64.44,11.96 64.85,12.37 D23.K | v33.6,64.77 30.94,67.44 29.36,67.44 | 29.36,67.44 25.38,67.44 23.9,68.91 16.43,68.91 D53.K | v11.79,41.5 4.09,33.81 D43.K | v48.59,71.35 46.15,68.91 29.77,68.91 29.36,68.5 29.36,67.44 | v61.57,50.44 v70.1,50.44 74.24,50.44 77.19,47.5 D13.K
COL4  (via drill 0.51)
  Top 0.203: v37.64,56.72 36.27,56.72 U101.21 | D54.K 19.51,71.25 19.51,70.08 v27.48,62.1 27.43,62.03 22.1,56.69 22.1,50.47 v22.05,50.42 22,50.34 19.91,48.26 19.91,7.52 21.16,7.52 21.21,7.57 21.36,7.57 21.41,7.62 21.54,7.62 21.59,7.67 21.74,7.67 21.79,7.72 21.92,7.72 21.97,7.77 23.93,7.77 24.66,7.04 D34.K | v53.77,59.31 53.77,71.42 56.59,74.24 D04.K
  Bottom 0.203: D34.K 24.82,6.88 52.45,6.88 54.41,4.93 55.5,4.93 56.01,5.44 56.01,5.56 56.08,5.64 56.08,5.77 56.16,5.84 56.16,5.94 56.21,5.99 56.21,6.1 56.29,6.17 56.29,6.27 56.31,6.27 56.77,6.73 58.29,6.73 58.4,6.63 59,6.63 59.59,7.21 59.59,7.34 59.64,7.39 59.64,7.54 59.69,7.59 59.69,7.72 59.74,7.77 59.74,7.92 59.79,7.98 59.79,8.1 61.7,10.01 61.77,10.01 D24.K | v27.48,62.1 32.26,62.1 v37.64,56.72 37.72,56.77 51.23,56.77 52.69,58.23 | v22.05,50.42 22,50.42 13.95,42.37 8.26,42.37 3.56,37.67 D44.K | 52.69,58.23 v53.77,59.31 | D14.K 71.65,49.71 61.21,49.71 52.69,58.23
COL5  (via drill 0.51)
  Top 0.203: v34.34,56.72 34.34,56.08 36.25,56.08 U101.22 | D55.K 22.84,73.3 22.84,67.82 v29.29,61.37 29.23,61.29 29.23,58.67 v22.84,52.27 22.78,52.2 22.78,10.39 21.29,8.89 D35.K | v67.84,46.91 60.02,54.74 60.02,72.39 D05.K
  Bottom 0.203: D35.K 21.29,8.87 21.36,8.79 57.63,8.79 58.45,7.98 D25.K | v34.34,56.72 29.69,61.37 v29.29,61.37 | v22.84,52.27 13.34,42.77 4.67,42.77 D45.K | D05.K 59.99,72.39 59.69,72.08 38.63,72.08 38.48,71.93 24.21,71.93 22.84,73.3 D55.K | v67.84,46.91 70.66,46.91 77.83,39.75 D15.K
COL6  (via drill 0.51)
  Top 0.203: D36.K 18.03,11.07 18.03,14.58 13.11,19.51 13.11,43.41 v13.01,43.51 13.06,43.59 18.19,48.72 18.19,71.25 18.24,71.3 18.24,71.58 18.29,71.63 18.29,71.88 18.34,71.93 18.34,71.96 19,72.62 21.46,72.62 21.46,73.25 21.51,73.3 21.51,73.43 21.57,73.48 21.57,73.64 21.61,73.69 21.61,73.81 21.67,73.86 21.67,74.02 21.72,74.07 21.72,74.12 22.25,74.65 23.72,74.65 23.82,74.55 26.31,74.55 26.31,74.98 D56.K | v38.15,72.67 38.1,72.62 38.1,65.02 38.18,64.95 38.18,61.44 38.38,61.24 38.38,55.42 36.27,55.42 U101.23 | v67.84,47.98 63.25,52.58 63.25,70.21 D06.K
  Bottom 0.203: D26.K 52.86,8.38 22.68,8.38 22.05,7.75 21.89,7.75 21.84,7.7 21.69,7.7 21.64,7.64 21.51,7.64 21.46,7.59 21.31,7.59 21.26,7.54 21.13,7.54 21.11,7.52 20.7,7.52 19.74,8.48 19.74,11.05 18.06,11.05 D36.K | v13.01,43.51 5.66,43.51 3.76,45.41 D46.K | D56.K 27.79,73.53 37.29,73.53 v38.15,72.67 38.23,72.72 56.97,72.72 57.76,73.51 59.26,73.51 59.31,73.56 59.46,73.56 59.51,73.61 59.64,73.61 59.69,73.66 59.84,73.66 59.89,73.71 60.02,73.71 60.07,73.76 60.35,73.76 60.58,73.53 61.37,73.53 61.37,72.08 63.22,70.23 D06.K | v67.84,47.98 67.11,47.98 67.11,46.28 77.52,35.87 D16.K
COL7  (via drill 0.51)
  Top 0.203: v43.92,13.11 51.26,5.77 51.26,5 D27.K 51.33,5.82 58.12,12.6 63.63,12.6 63.63,22.78 68.45,27.61 69.16,27.61 69.16,33.81 68.63,34.34 68.63,40.21 v68.58,40.28 68.58,63.37 66.22,65.73 66.22,67.67 D07.K | v34.34,54.51 34.34,54.76 U101.24 | v32.13,54.51 30.02,56.62 30.02,68.17 | 30.02,68.17 30.02,76.28 D57.K | v30.1,68.17 30.02,68.17
  Bottom 0.203: v43.92,13.11 15.57,13.11 D37.K | v34.34,54.51 v32.13,54.51 32.05,54.46 5.54,54.46 5.41,54.33 4.19,54.33 4.19,52.78 4.29,52.68 4.29,52.58 4.39,52.48 4.39,52.4 4.47,52.32 4.47,52.25 4.55,52.17 4.55,52.09 4.62,52.02 4.62,51.59 4.45,51.41 4.45,49.28 D47.K | v30.1,68.17 65.71,68.17 D07.K | v68.58,40.28 D17.K
COL8  (via drill 0.51)
  Top 0.203: v34.34,53.44 35,54.1 U101.25 | D38.K 12.37,16.43 10.62,18.19 10.03,18.19 9.98,18.24 9.7,18.24 9.65,18.29 9.4,18.29 9.35,18.34 8.66,18.34 8.66,20.93 8.1,21.49 7.95,21.49 7.9,21.54 7.75,21.54 7.7,21.59 7.57,21.59 7.52,21.64 7.37,21.64 7.32,21.69 7.19,21.69 6.63,22.25 6.63,23.72 7.64,24.74 7.64,50.88 D48.K | v43.33,9.53 43.33,8.23 47.47,4.09 D28.K | v32.87,53.09 32.87,63.91 | 32.87,63.91 32.87,76.28 33.78,77.19 D58.K | 32.87,63.91 v32.94,63.91 | v69.37,34.67 69.32,34.72 69.32,64.44 68.91,64.85 D08.K
  Bottom 0.203: v34.34,53.44 33.91,53.01 32.87,53.01 | 32.87,53.01 5.54,53.01 D48.K | v43.33,9.53 43.03,9.83 22.1,9.83 19.53,12.39 15.7,12.39 15.65,12.34 15.01,12.34 14.99,12.32 14.55,12.32 13.54,13.34 13.54,16.41 D38.K | 32.87,53.01 v32.87,53.09 | v32.94,63.91 67.94,63.91 68.89,64.85 D08.K | v69.37,34.67 D18.K
COL9  (via drill 0.51)
  Top 0.203: D29.K 43.64,3.53 46.33,3.53 46.33,3.35 46.97,2.72 48.28,2.72 48.28,2.97 48.41,3.1 48.41,3.17 48.54,3.3 48.54,3.38 48.69,3.53 48.69,3.61 48.82,3.73 48.82,3.76 49.07,4.01 50.42,4.01 50.8,3.63 52.2,3.63 52.2,4.01 52.27,4.09 52.27,4.17 52.35,4.24 52.35,4.32 52.43,4.39 52.43,4.47 52.5,4.55 52.5,4.62 52.6,4.72 52.6,4.83 53.59,5.82 53.59,6.86 58.06,11.33 64.14,11.33 64.14,11.3 64.34,11.1 66.12,11.1 66.12,12.47 66.17,12.52 66.17,12.83 67.13,13.79 68.96,13.79 68.96,15.47 68.94,15.49 68.94,15.72 69.95,16.74 71.17,16.74 71.17,17.25 71.53,17.6 71.53,17.98 71.48,18.03 71.48,18.31 71.42,18.36 71.42,18.64 71.4,18.67 71.4,19 72.34,19.94 73.61,19.94 73.61,20.83 73.76,20.98 73.76,21.21 73.71,21.26 73.71,21.39 73.66,21.44 73.66,21.59 73.61,21.64 73.61,21.77 73.56,21.82 73.56,21.97 73.51,22.02 73.51,23.93 74.24,24.66 D19.K 74.27,24.79 74.4,24.92 74.4,52.45 76.35,54.41 76.35,55.5 75.84,56.01 75.72,56.01 75.64,56.08 75.51,56.08 75.44,56.16 75.34,56.16 75.29,56.21 75.18,56.21 75.11,56.29 75.01,56.29 75.01,56.31 74.55,56.77 74.55,58.29 74.65,58.4 74.65,59.03 74.09,59.59 73.94,59.59 73.89,59.64 73.74,59.64 73.69,59.69 73.56,59.69 73.51,59.74 73.36,59.74 73.3,59.79 73.18,59.79 71.27,61.7 71.27,61.77 D09.K | D39.K 9.32,20.19 9.32,54.3 7.04,56.59 D49.K | 38.79,61.77 38.79,64.92 38.51,65.2 38.51,71.96 38.89,72.34 38.89,76.5 37.67,77.72 D59.K | 38.79,55.98 38.79,61.77 | 38.79,55.98 38.79,53.47 36.27,53.47 U101.26 | 38.79,61.77 v38.91,61.77 | v39.12,55.98 38.79,55.98
  Bottom 0.203: v38.91,61.77 71.25,61.77 D09.K | v39.12,55.98 7.64,55.98 7.04,56.59 D49.K
CS0  (via drill 0.51)
  Top 0.203: 25.02,20.02 v26.52,18.52 | v44.2,18.52 44.83,19.15 45.06,19.15 45.06,19.89 44.83,20.12 43.94,20.12 U401.31
  Bottom 0.203: v26.52,18.52 v44.2,18.52
GND  (via drill 0.51)  (1 unrouted)
  Top 0.152: 60.53,31.48 C201.2
  Top 0.203: 57.53,19.56 58.29,20.32 C451.2 | 57.53,19.56 56.24,19.56 56.24,19.91 56.03,20.12 55.14,20.12 U401.50 55.04,20.09 53.75,20.09 53.75,16.84 53.57,16.66 50.62,16.66 50.55,16.61 | 50.55,16.61 50.55,15.11 51.56,14.1 C443.2 | 50.55,16.61 50.29,16.87 50.29,17.75 U401.42 | U401.6 50.8,28.98 50.8,30.61 51.05,30.86 51.05,31.85 50.34,32.56 C407.2 50.29,35.1 C002.2 50.04,35.18 51.56,35.18 R014.1 51.64,35.23 53.01,35.23 v53.01,35.38 | C202.2 63.25,36.98 61.95,38.28 61.95,38.43 U201.5 61.85,38.43 61.37,38.43 U201.6 61.27,38.43 60.73,38.43 U201.7 60.07,38.43 U201.8 | U201.8 59.97,38.28 58.67,36.98 C203.2 58.62,36.88 57.86,36.12 57.86,35.38 | 59.77,25.48 C461.1 | 59.77,25.48 Y401.2 59.21,25.38 59.21,25.35 58.32,24.46 58.32,23.98 57.63,23.29 | C462.1 59.82,26.42 59.82,25.55 59.77,25.48 | 57.86,28.07 60.53,28.07 | 57.86,28.07 56.9,28.07 C463.2 | 60.53,28.07 60.53,27.25 C462.1 | 57.78,23.57 56.77,24.59 56.77,24.61 55.14,24.61 U401.59 | 57.86,35.38 57.86,28.07 | 57.86,35.38 v57.58,35.38 | v57.66,19.3 57.66,19.41 57.58,19.48 57.53,19.56 | v61.87,23.37 61.87,25.7 60.55,27.03 C462.1 | SJ3.1 v49.53,47.12 SJ1.1 53.42,47.07 53.9,47.07 54.59,46.38 54.59,43.89 59.94,38.53 U201.8 | SJ5.1 43.89,47.83 v43.89,48.08 | v29.21,47.12 SJ10.1 | v29.21,47.12 SJ11.1 | U401.25 43.92,23.14 41.25,23.14 40.26,24.13 C423.2 40.31,24.21 41.76,25.65 41.76,25.98 42.75,26.98 42.82,26.98 | 40.13,35.18 40.89,35.18 40.95,35.1 40.95,35.08 42.82,33.2 42.82,26.98 | 40.13,35.18 39.37,35.18 | 42.82,26.98 42.82,26.82 43.03,26.62 43.92,26.62 U401.18 | J403.5 35.81,30.3 34.72,30.3 34.72,33.71 35.31,34.29 J403.1 35.87,34.37 36.47,34.98 v36.47,37.74
  Top 0.203: C120.1 34.29,59.31 35.18,58.42 35.18,58.34 35.51,58.01 U101.19 36.35,57.96 v37.64,57.96 | 36.85,47.12 SJ7.1 38.15,47.19 39.85,48.9 39.85,56.69 | 36.85,47.12 36.85,41.43 37.38,40.91 | 37.38,40.91 38.1,40.18 J002.5 | 39.85,56.69 43.48,56.69 U101.8 | v39.52,57.51 39.8,57.23 39.8,56.77 39.85,56.69 | 40.13,35.18 40.13,37.08 41.88,38.84 41.88,43.97 41.17,44.68 39.34,44.68 39.34,42.88 37.38,40.91 | v36.83,47.12 36.85,47.12 | 30.63,29.29 30.63,37.44 29.23,38.84 29.23,47.04 v29.21,47.12 | 60.53,28.07 60.53,31.48
  Bottom 0.203: v57.58,35.38 v53.01,35.38 | v57.66,19.3 61.72,23.37 v61.87,23.37 | SJ2.1 v49.53,47.12 SJ4.1 44.86,47.12 v43.89,48.08 43.81,48.03 43.48,47.7 41.25,47.7 40.72,47.17 SJ6.1 v36.83,47.12 SJ8.1 v29.21,47.12 | v37.64,57.96 38.1,57.51 v39.52,57.51 | J002.5 v36.47,37.74
H_RST  (via drill 0.51)
  Top 0.203: v59.72,19.89 59.72,13.01 50.09,13.01 47.95,15.14 47.95,15.8 48.26,16.1 48.26,17.75 U401.38
  Bottom 0.203: SJ2.3 J101.10 50.88,43.38 52.07,42.19 63.88,42.19 63.88,24.05 v59.72,19.89
H_TICK  (via drill 0.51)
  Top 0.203: SJ1.3 J101.11 53.39,43.36 55.22,41.53 55.22,29.69 v54.48,28.96 | v49.71,25.22 48.82,24.33 48.82,17.8 48.79,17.78 U401.39
  Bottom 0.203: v49.71,25.22 52.07,27.58 52.07,28.07 52.3,28.07 53.19,28.96 v54.48,28.96
ISPCLK  (via drill 0.51)
  Top 0.203: SJ11.2 27,46.23 v27,48.01 | v34.85,52.15 35.51,52.81 U101.27
  Bottom 0.203: v27,48.01 31.14,52.15 v34.85,52.15
ISPCLKC
  Top 0.203: SJ11.3 J101.1
ISPDAT  (via drill 0.51)
  Top 0.203: SJ10.2 31.42,46.23 31.42,48.51 v31.34,48.59 | v34.34,49.78 36.25,51.69 36.25,52.15 U101.28
  Bottom 0.203: v31.34,48.59 32.54,49.78 v34.34,49.78
ISPDATC
  Top 0.203: SJ10.3 J101.2
M_RST  (via drill 0.51)
  Top 0.203: v47.07,27.51 47.07,24.89 46.81,24.64 46.81,17.8 U401.35
  Bottom 0.203: SJ4.3 J101.8 45.77,43.36 46.97,43.36 46.97,38.89 47.7,38.15 47.7,28.14 v47.07,27.51
M_TICK  (via drill 0.51)
  Top 0.203: SJ3.3 J101.9 48.31,43.36 48.31,42.19 52.3,42.19 54.59,39.9 54.59,30.12 v54.48,30.02 | v49.71,26.29 47.8,24.38 47.8,17.78 U401.37
  Bottom 0.203: v49.71,26.29 53.44,30.02 v54.48,30.02
MCLR  (via drill 0.51)
  Top 0.203: SJ9.2 32.08,46.23 32.08,47.8 v32.87,48.59 | v42.65,51.31 43.48,52.15 U101.1
  Bottom 0.203: v32.87,48.59 33.33,49.05 40.39,49.05 v42.65,51.31
MCLRC
  Top 0.203: SJ9.3 J101.3
MISO0  (via drill 0.51)
  Top 0.203: v31.62,21.18 28.63,24.18 | v42.49,21.18 42.98,21.18 43.03,21.13 43.92,21.13 U401.29
  Bottom 0.203: v31.62,21.18 v42.49,21.18
MOSI0  (via drill 0.51)
  Top 0.203: 25.53,21.08 26.06,21.08 26.26,20.88 v29.29,20.88 | v41.71,20.45 42.88,20.45 43.03,20.6 43.92,20.6 U401.30
  Bottom 0.203: v29.29,20.88 29.72,20.45 v41.71,20.45
N$1
  Top 0.203: C202.1 61.32,35.66 61.32,34.24 U201.3
N$3  (via drill 0.51)
  Top 0.203: v60.58,35.66 C203.1 | v62.74,34.67 61.95,34.67 61.95,34.21 U201.4
  Bottom 0.203: v60.58,35.66 61.57,34.67 v62.74,34.67
PPS  (via drill 0.51)
  Top 0.203: v37.9,22.3 36.93,23.27 36.93,28.17 J403.6 | v51.18,20.12 52.27,19.02 U401.46
  Bottom 0.203: v37.9,22.3 38.28,21.92 49.38,21.92 v51.18,20.12
RESET  (via drill 0.51)
  Top 0.203: R457.1 57,21.59 56.24,22.35 56.24,23.42 56.06,23.6 55.14,23.6 U401.57 55.04,23.65 v51.18,23.65
  Bottom 0.203: v51.18,23.65 50.34,24.49 37.44,24.49 26.7,35.23 26.7,40.62 29.23,40.62 J002.2
ROW00
  Top 0.203: D09.A 71.65,64.31 69.04,66.93 69.04,67.39 D08.A | R101.8 47.73,61.49 47.85,61.62 47.85,78.97 D02.A
  Bottom 0.203: D08.A 69.01,67.41 66.22,70.21 66.09,70.21 D07.A 65.96,70.23 65.3,70.23 62.84,72.69 D06.A 62.74,72.75 60.66,74.83 59.46,74.83 D05.A 59.36,74.88 57.63,76.61 55.78,76.61 D04.A 54.36,77.95 51.92,77.95 D03.A 51.82,78.03 50.88,78.97 D02.A 47.78,78.99 44.4,78.99 43.92,79.48 D01.A 39.85,79.53 D00.A
ROW00C
  Top 0.203: R101.1 45.74,61.47 43.51,61.47 43.51,60.63 U101.14
ROW10  (via drill 0.51)
  Top 0.203: v49.1,60.6 47.73,60.6 R101.7 | D19.A 78,26.98 D18.A 78.03,29.54 78.92,30.43 78.92,33.33 D17.A 78.99,33.43 79.5,33.93 79.5,37.44 D16.A 79.55,37.54 79.55,41.45 D15.A 79.6,41.63 79.6,45.34 79.35,45.59 D14.A 79.27,45.7 79.27,48.95 78.61,49.61 D13.A 78.54,49.71 78.54,52.48 77.47,53.54 D12.A 77.42,53.65 77.42,55.8 75.92,57.3 D11.A 75.84,57.4 75.84,59.03 73.97,60.91 D10.A
  Bottom 0.203: v49.1,60.6 49.25,60.45 73.48,60.45 73.94,60.91 D10.A
ROW10C
  Top 0.203: R101.2 45.74,60.58 44.58,60.58 44.58,60.3 44.25,59.97 U101.13
ROW20  (via drill 0.51)
  Top 0.203: v68.43,28.35 68.43,33.43 52.63,49.23 52.63,59.79 47.73,59.79 R101.6 | D20.A 74.85,21.89 74.85,20.6 72.72,18.47 D21.A 72.67,18.36 72.67,17.65 D22.A
  Bottom 0.203: D22.A 70.21,15.19 67.36,12.34 D23.A 67.39,12.24 66.93,12.24 64.31,9.63 D24.A 64.21,9.55 62,7.34 61.01,7.34 D25.A 60.91,7.32 59.03,5.44 57.4,5.44 D26.A 57.3,5.36 55.8,3.86 53.65,3.86 D27.A 53.54,3.81 52.48,2.74 49.71,2.74 D28.A 49.61,2.67 46.33,2.67 D29.A | v68.43,28.35 D20.A
ROW20C
  Top 0.203: R101.3 45.74,59.79 44.65,59.79 44.65,59.72 44.27,59.33 43.51,59.33 U101.12
ROW30  (via drill 0.51)
  Top 0.203: v46.81,54.41 46.81,57.02 47.7,57.02 R102.7 | D38.A 12.24,13.89 9.63,16.51 9.63,16.97 D39.A
  Bottom 0.203: D38.A 12.27,13.87 12.39,13.87 15.19,11.07 D37.A 15.32,11.05 17.75,8.61 18.36,8.61 D36.A 18.47,8.56 20.57,6.45 21.82,6.45 D35.A 21.92,6.4 23.65,4.67 25.5,4.67 D34.A 26.92,3.33 29.36,3.33 D33.A 29.46,3.25 30.4,2.31 D32.A 33.5,2.29 36.88,2.29 37.36,1.8 D31.A 37.57,1.65 41.53,1.65 D30.A | v46.81,54.41 40.26,47.85 28.88,47.85 7.64,26.62 7.64,24.08 7.34,24.08 6.63,23.37 6.63,21.72 7.26,21.72 7.32,21.67 7.44,21.67 7.49,21.61 7.64,21.61 7.7,21.57 7.82,21.57 7.87,21.51 8.03,21.51 8.08,21.46 8.13,21.46 8.69,20.9 8.69,16.99 9.6,16.99 D39.A
ROW30C
  Top 0.203: R102.2 45.74,57.05 44.55,57.05 44.25,57.35 U101.9
ROW40  (via drill 0.51)
  Top 0.203: D40.A 5.44,22.25 5.44,23.88 D41.A 3.86,25.48 3.86,27.64 D42.A 3.81,27.74 2.74,28.8 2.74,31.57 D43.A 2.67,31.67 2.01,32.33 2.01,35.59 D44.A 1.93,35.69 1.68,35.94 1.68,39.65 D45.A 1.75,39.85 D46.A 1.8,43.92 1.8,47.37 2.29,47.85 D47.A 2.36,47.95 2.36,50.93 3.25,51.82 D48.A 3.33,51.92 4.19,52.78 4.19,55.22 D49.A | v48.95,56.03 48.95,57.91 47.73,57.91 R102.8
  Bottom 0.203: v48.95,56.03 48.16,55.24 5.11,55.24 4.67,55.68 D49.A
ROW40C
  Top 0.203: R102.1 45.74,57.94 43.51,57.94 43.51,57.99 U101.10
ROW50  (via drill 0.51)
  Top 0.203: D50.A 6.43,59.38 7.92,60.88 7.92,62.18 8.56,62.81 D51.A 8.61,62.92 11.05,65.35 11.05,65.96 D52.A 11.07,66.09 13.87,68.89 13.87,69.01 D53.A | v40.92,76.3 46.66,70.56 46.66,58.93 47.7,58.93 R101.5
  Bottom 0.203: v40.92,76.3 37.9,79.32 35.69,79.32 D59.A 35.59,79.27 32.33,79.27 31.67,78.61 D58.A 31.57,78.54 28.83,78.54 27.81,77.52 D57.A 27.71,77.44 25.5,77.44 23.98,75.92 D56.A 23.88,75.84 22.28,75.84 20.45,74.02 D55.A 20.34,73.94 19.25,73.94 16.99,71.68 D54.A 16.89,71.63 16.48,71.63 13.89,69.04 D53.A
ROW50C
  Top 0.203: R101.4 45.74,58.9 44.48,58.9 44.25,58.67 43.51,58.67 U101.11
RX0  (via drill 0.51)
  Top 0.203: v37.67,27.38 37.67,31.27 35.81,31.27 J403.4 | v42.49,25.65 43.03,25.12 43.92,25.12 U401.21 | J002.4 34.8,38.61 34.8,34.8 33.98,33.98 v33.98,31.09
  Bottom 0.203: v42.49,25.65 39.4,25.65 v37.67,27.38 37.62,27.46 v33.98,31.09
RX1  (via drill 0.51)
  Top 0.203: v46.33,25.22 46.33,23.01 46.3,22.99 46.3,17.78 U401.34
  Bottom 0.203: v46.33,25.22 51.87,30.76 58.93,30.76 59.33,31.17 59.33,33.53 53.8,33.53 52.27,35.05 52.27,39.37 J002.11
S_RST  (via drill 0.51)
  Top 0.203: v52.78,19.58 U401.47 | v41.71,19.38 38.63,22.45 v38.63,33.55 | v38.63,37.39 39.4,38.15 39.4,42.19 J101.6
  Bottom 0.203: J101.6 SJ6.3 | v52.78,19.58 52.58,19.38 v41.71,19.38 | v38.63,33.55 v38.63,37.39
S_TICK  (via drill 0.51)
  Top 0.203: J101.7 SJ5.3 | v51.64,21.64 55.12,21.64 U401.53
  Bottom 0.203: v51.64,21.64 49.2,24.08 37.26,24.08 26.29,35.05 26.29,42.19 41.94,42.19 J101.7
SCK0  (via drill 0.51)
  Top 0.203: 27.08,22.63 v28.07,21.64 | v40.28,23.04 40.77,23.04 41.68,22.12 43.92,22.12 U401.27
  Bottom 0.203: v28.07,21.64 29.46,23.04 v40.28,23.04
T_RST
  Bottom 0.203: SJ8.3 J101.4
T_TICK
  Top 0.203: SJ7.3 J101.5
TX0  (via drill 0.51)
  Top 0.203: v37.24,32.31 35.81,32.31 J403.3 | v32.89,34.34 32.36,34.87 32.36,38.71 J002.3 | v45.39,26.14 43.94,26.14 U401.19
  Bottom 0.203: v32.89,34.34 35.2,34.34 v37.24,32.31 37.31,32.26 42.49,27.08 44.45,27.08 v45.39,26.14
TX1  (via drill 0.51)
  Top 0.203: v44.98,17.78 U401.33
  Bottom 0.203: v44.98,17.78 45.7,18.49 54.99,18.49 63.48,26.98 63.48,38.79 55.7,38.79 53.87,40.62 52.05,40.62 J002.10
USB_ON
  Top 0.203: 48.51,35.18 47.02,36.68 47.02,39.9 47.73,40.62 52.09,40.62 52.09,38.2 53.75,36.55 53.75,26.57 52.93,25.76 52.93,25.09 53.9,24.13 55.12,24.13 U401.58
USB_SOFTCONNECT
  Top 0.203: 45.26,34.04 44.96,33.73 44.96,28.14 43.94,27.13 U401.17
USBD+  (via drill 0.51)
  Top 0.203: v46.76,32.44 48.74,30.45 48.74,29.01 48.77,28.98 U401.10 | 42.49,35.1 v43.43,34.16
  Bottom 0.203: v46.76,32.44 45.03,34.16 v43.43,34.16
USBD-  (via drill 0.51)
  Top 0.203: v45.7,32.44 48.26,29.87 48.26,28.98 U401.11 | v40.39,32.87 38.02,35.23
  Bottom 0.203: v45.7,32.44 45.26,32.87 v40.39,32.87
VBUS  (via drill 0.51)
  Top 0.152: U201.2 60.58,34.21
  Top 0.203: 48.92,36.47 50.04,36.47 C002.1 50.11,36.47 51.56,36.47 R014.2 | 48.92,36.47 48.51,36.47 48.46,36.55 48.26,36.75 J002.9 | U201.2 59.99,34.21 U201.1 59.92,34.14 58.6,32.82 v58.6,32.79 | U101.20 36.25,57.38 34.92,57.38 C120.2 34.34,57.84 33.66,57.15 33.66,57.12 33.6,57.05 33.6,49.33 | 60.58,34.21 C201.1 | SJ9.1 33.6,47.7 33.6,49.33 | v44.42,40.36 44.42,38.68 46.99,36.12 46.99,34.77 48.69,34.77 48.92,35 48.92,36.47 | v28.14,41.45 26.26,43.33 26.26,48.34 27.25,49.33 33.6,49.33
  Bottom 0.203: v58.6,32.79 58.27,33.12 53.62,33.12 48.26,38.48 J002.9 | v44.42,40.36 43.33,41.45 v28.14,41.45
VCC  (via drill 0.51)
  Top 0.203: C423.1 43.92,24.13 U401.23 44.02,24.08 45.59,24.08 v45.59,23.34 | 56.24,26.77 56.19,26.77 56.03,26.62 55.14,26.62 U401.63 | 56.24,26.77 C463.1 | 52.25,28.04 52.25,28.93 52.27,28.96 U401.3 | 52.25,28.04 52.05,27.84 50.44,27.84 | 50.44,27.84 50.32,27.84 50.32,28.88 U401.7 50.29,28.98 C407.1 50.22,31.01 47.19,34.04 47.14,34.11 47.09,34.09 v46.13,35.05 | v55.73,27.91 56.24,27.41 56.24,26.77 | v52.81,27.51 52.32,27.99 52.25,28.04 | 52.21,14.72 51.56,15.37 C443.1 | 52.21,14.72 52.32,14.61 52.32,13.41 50.95,13.41 R441.2 | 52.21,14.72 54.15,16.66 54.15,18.64 55.12,19.61 U401.49 55.22,19.58 56.24,18.57 58.98,18.57 58.98,21.64 | 50.51,20.51 50.85,20.85 54,20.85 54.23,20.62 55.12,20.62 U401.51 55.22,20.57 56.16,20.57 56.36,20.37 56.92,20.37 C451.1 57.02,20.32 58.29,21.59 R457.2 58.4,21.64 58.98,21.64 | 50.51,20.51 50.44,20.45 50.44,19.79 50.75,19.48 50.75,17.8 U401.43 | 61.32,34.11 61.47,33.96 61.47,26.7 62.61,25.55 62.61,23.04 61.21,21.64 58.98,21.64 | 50.44,27.84 50.44,20.57 50.51,20.51 | v37.24,34.19 37.24,33.3 J403.2 | 29.39,29.29 29.9,29.79 v29.9,33.1 | 33.35,47.32 34.27,46.41 v34.27,40.36
  Bottom 0.203: v55.73,27.91 55.32,27.51 v52.81,27.51 52.76,27.43 52.76,21.69 51.97,20.9 51.31,20.9 49.89,22.33 46.61,22.33 v45.59,23.34 | v37.24,34.19 37.9,34.85 37.9,35.08 | 37.9,35.08 37.9,38.12 39.4,38.12 J002.6 40.72,39.32 41.91,38.12 43.05,38.12 v46.13,35.05 | v29.9,33.1 31.88,35.08 34.27,35.08 | 34.27,35.08 37.9,35.08 | 34.27,35.08 v34.27,40.36
XTAL3
  Top 0.203: C462.2 58.6,26.49 57.66,26.49 57.66,25.53 57.63,25.5 Y401.3 57.58,26.11 55.14,26.11 U401.62
XTAL4  (via drill 0.51)
  Top 0.203: Y401.1 59.23,23.27 59.23,23.24 C461.2 60.76,23.32 61.47,24.03 61.47,25.02 v60.96,25.53 | v53.67,25.43 53.67,25.6 55.12,25.6 U401.61
  Bottom 0.203: v53.67,25.43 53.77,25.53 v60.96,25.53

### Text on the board
tPlace: Project Precision | 7 Aug 2011 | St Kwan's Home for | hour | the Terminally ADD | ICSP | minute | second | third | a division of | Kwan Systems | TICK
bPlace: hour | minute | second | third | RESET